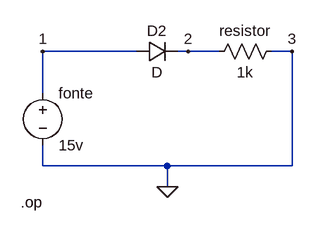
[diagram p0: schematic dr.asc]
dr.asc, the LTspice schematic file:
Version 4
SHEET 1 880 680
WIRE 176 160 32 160
WIRE 256 160 240 160
WIRE 304 160 256 160
WIRE 416 160 384 160
WIRE 32 224 32 160
WIRE 32 336 32 304
WIRE 224 336 32 336
WIRE 416 336 416 160
WIRE 416 336 224 336
WIRE 224 368 224 336
FLAG 224 368 0
FLAG 32 160 1
FLAG 256 160 2
FLAG 416 160 3
SYMBOL voltage 32 208 R0
SYMATTR InstName fonte
SYMATTR Value 15v
SYMBOL diode 176 176 R270
WINDOW 0 32 32 VTop 2
WINDOW 3 0 32 VBottom 2
SYMATTR InstName D2
SYMBOL res 400 144 R90
WINDOW 0 0 56 VBottom 2
WINDOW 3 32 56 VTop 2
SYMATTR InstName resistor
SYMATTR Value 1k
TEXT -2 392 Left 2 !.op

The netlist it stands for:
* dr.asc
V§fonte 1 0 15v
D2 1 2 D
resistor 0 2 1k
.model D D
.lib standard.dio
.op
.backanno
.end